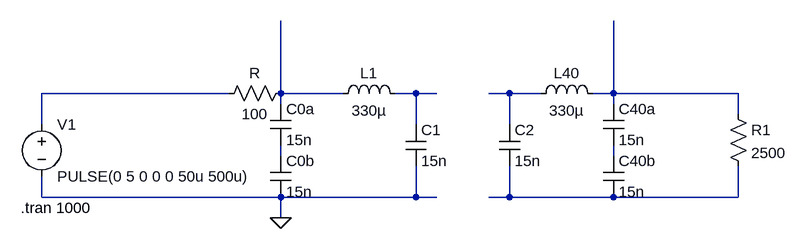
[diagram p0: schematic LTSpice Simulation (shortened).asc]
LTSpice Simulation (shortened).asc, the LTspice schematic file:
Version 4
SHEET 1 6812 680
WIRE 80 144 -208 144
WIRE 160 144 160 32
WIRE 256 144 160 144
WIRE 368 144 336 144
WIRE 400 144 368 144
WIRE 512 144 480 144
WIRE 560 144 512 144
WIRE 672 144 672 32
WIRE 672 144 640 144
WIRE 864 144 672 144
WIRE 160 160 160 144
WIRE 672 160 672 144
WIRE 864 176 864 144
WIRE -208 192 -208 144
WIRE 368 192 368 144
WIRE 512 192 512 144
WIRE 160 240 160 224
WIRE 672 240 672 224
WIRE -208 304 -208 272
WIRE 160 304 -208 304
WIRE 368 304 368 256
WIRE 368 304 160 304
WIRE 400 304 368 304
WIRE 512 304 512 256
WIRE 512 304 480 304
WIRE 672 304 512 304
WIRE 864 304 864 256
WIRE 864 304 672 304
WIRE 160 336 160 304
FLAG 160 336 0
SYMBOL cap 144 160 R0
SYMATTR InstName C0a
SYMATTR Value 15n
SYMBOL cap 144 240 R0
SYMATTR InstName C0b
SYMATTR Value 15n
SYMBOL res 176 128 R90
WINDOW 0 0 56 VBottom 2
WINDOW 3 32 56 VTop 2
SYMATTR InstName R
SYMATTR Value 100
SYMBOL voltage -208 176 R0
WINDOW 123 0 0 Left 0
WINDOW 39 0 0 Left 0
SYMATTR InstName V1
SYMATTR Value PULSE(0 5 0 0 0 50u 500u)
SYMBOL ind 240 160 R270
WINDOW 0 32 56 VTop 2
WINDOW 3 5 56 VBottom 2
SYMATTR InstName L1
SYMATTR Value 330µ
SYMBOL cap 352 192 R0
SYMATTR InstName C1
SYMATTR Value 15n
SYMBOL ind 544 160 R270
WINDOW 0 32 56 VTop 2
WINDOW 3 5 56 VBottom 2
SYMATTR InstName L40
SYMATTR Value 330µ
SYMBOL cap 656 160 R0
SYMATTR InstName C40a
SYMATTR Value 15n
SYMBOL cap 656 240 R0
SYMATTR InstName C40b
SYMATTR Value 15n
SYMBOL res 848 160 R0
SYMATTR InstName R1
SYMATTR Value 2500
SYMBOL cap 496 192 R0
SYMATTR InstName C2
SYMATTR Value 15n
TEXT -240 320 Left 2 !.tran 1000

The netlist it stands for:
* LTSpice Simulation (shortened).asc
C0a N002 N006 15n
C0b N006 0 15n
R N002 N001 100
V1 N001 0 PULSE(0 5 0 0 0 50u 500u)
L1 N002 N003 330µ
C1 N003 0 15n
L40 N004 N005 330µ
C40a N005 N007 15n
C40b N007 N008 15n
R1 N005 N008 2500
C2 N004 N008 15n
.tran 1000
.backanno
.end